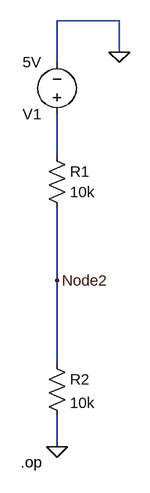
[diagram p0: schematic divider.asc]
divider.asc, the LTspice schematic file:
Version 4.1
SHEET 1 880 680
WIRE 304 -176 208 -176
WIRE 304 -128 304 -176
WIRE 208 -112 208 -176
WIRE 208 32 208 -32
WIRE 208 224 208 112
WIRE 208 352 208 224
WIRE 208 480 208 432
FLAG 208 480 0
FLAG 304 -128 0
FLAG 208 224 Node2
SYMBOL voltage 208 -16 R180
WINDOW 123 0 0 Left 0
WINDOW 39 0 0 Left 0
SYMATTR InstName V1
SYMATTR Value 5V
SYMBOL res 192 16 R0
WINDOW 3 36 72 Left 2
SYMATTR InstName R1
SYMATTR Value 10k
SYMBOL res 192 336 R0
SYMATTR InstName R2
SYMATTR Value 10k
TEXT 152 504 Left 2 !.op

The netlist it stands for:
* divider.asc
V1 N001 0 5V
R1 N001 Node2 10k
R2 Node2 0 10k
.op
.backanno
.end